# EAGLE design TXn_v1.2 (EAGLE 8.6.2)
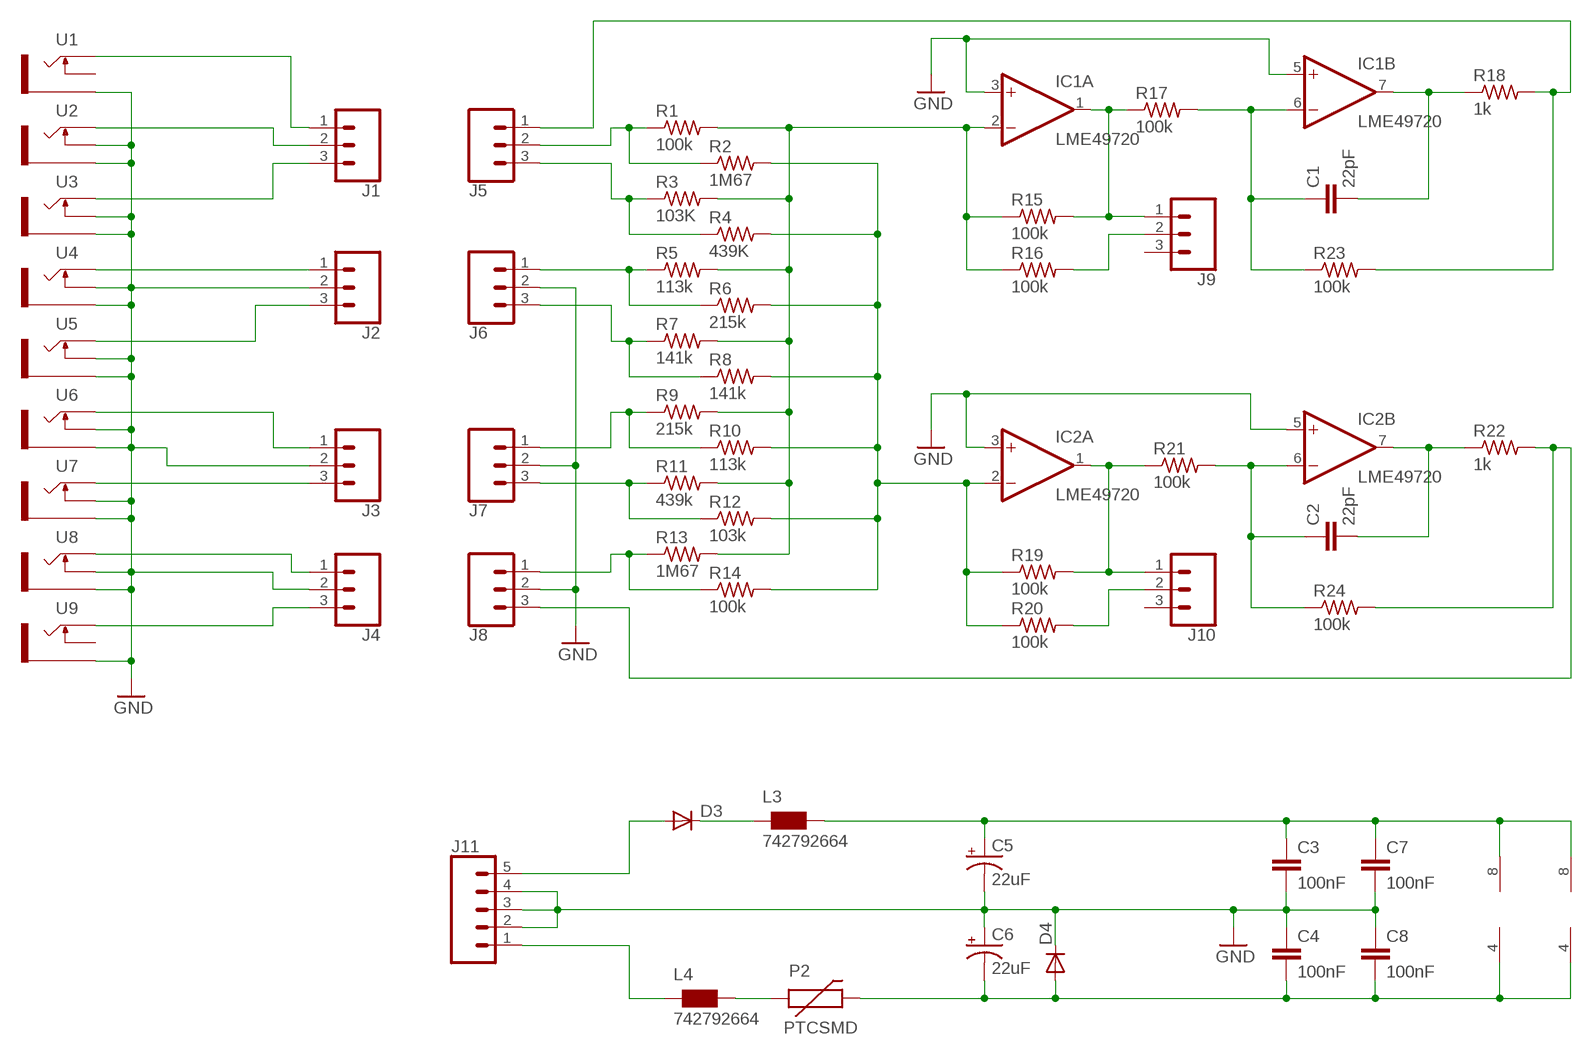
[diagram p0: schematic, sheet 1]

## Parts
C1  22pF  CAP0603-CAP  [0603-CAP]
C2  22pF  CAP0603-CAP  [0603-CAP]
C3  100nF  CAP0603-CAP  [0603-CAP]
C4  100nF  CAP0603-CAP  [0603-CAP]
C5  22uF  CPOL-USB  [PANASONIC_B]
C6  22uF  CPOL-USB  [PANASONIC_B]
C7  100nF  CAP0603-CAP  [0603-CAP]
C8  100nF  CAP0603-CAP  [0603-CAP]
D3  DIODE-SOD123  [SOD123]
D4  DIODE-SOD123  [SOD123]
IC1  LME49720  TL072D  [SO08]
IC2  LME49720  TL072D  [SO08]
J1  CONN_031X03_NO_SILK  [1X03_NO_SILK]
J2  CONN_031X03_NO_SILK  [1X03_NO_SILK]
J3  CONN_031X03_NO_SILK  [1X03_NO_SILK]
J4  CONN_031X03_NO_SILK  [1X03_NO_SILK]
J5  CONN_031X03_NO_SILK  [1X03_NO_SILK]
J6  CONN_031X03_NO_SILK  [1X03_NO_SILK]
J7  CONN_031X03_NO_SILK  [1X03_NO_SILK]
J8  CONN_031X03_NO_SILK  [1X03_NO_SILK]
J9  CONN_031X03_NO_SILK  [1X03_NO_SILK]
J10  CONN_031X03_NO_SILK  [1X03_NO_SILK]
J11  CONN_05NO_SILK  [1X05_NO_SILK]
L3  742792664  WE-CBF_0603  [0603]
L4  742792664  WE-CBF_0603  [0603]
P2  PTCSMD  [PTC-1206]
R1  100k  R-US_R0603  [R0603]
R2  1M67  R-US_R0603  [R0603]
R3  103K  R-US_R0603  [R0603]
R4  439K  R-US_R0603  [R0603]
R5  113k  R-US_R0603  [R0603]
R6  215k  R-US_R0603  [R0603]
R7  141k  R-US_R0603  [R0603]
R8  141k  R-US_R0603  [R0603]
R9  215k  R-US_R0603  [R0603]
R10  113k  R-US_R0603  [R0603]
R11  439k  R-US_R0603  [R0603]
R12  103k  R-US_R0603  [R0603]
R13  1M67  R-US_R0603  [R0603]
R14  100k  R-US_R0603  [R0603]
R15  100k  R-US_R0603  [R0603]
R16  100k  R-US_R0603  [R0603]
R17  100k  R-US_R0603  [R0603]
R18  1k  R-US_R0603  [R0603]
R19  100k  R-US_R0603  [R0603]
R20  100k  R-US_R0603  [R0603]
R21  100k  R-US_R0603  [R0603]
R22  1k  R-US_R0603  [R0603]
R23  100k  R-US_R0603  [R0603]
R24  100k  R-US_R0603  [R0603]
U1  THONKICONNLEFT  [WQP-PJ301M-12_JACK_L]
U2  THONKICONNLEFT  [WQP-PJ301M-12_JACK_L]
U3  THONKICONNLEFT  [WQP-PJ301M-12_JACK_L]
U4  THONKICONNLEFT  [WQP-PJ301M-12_JACK_L]
U5  THONKICONNLEFT  [WQP-PJ301M-12_JACK_L]
U6  THONKICONNLEFT  [WQP-PJ301M-12_JACK_L]
U7  THONKICONNLEFT  [WQP-PJ301M-12_JACK_L]
U8  THONKICONNLEFT  [WQP-PJ301M-12_JACK_L]
U9  THONKICONNLEFT  [WQP-PJ301M-12_JACK_L]

## Nets
BMIX: IC2.2(A:-IN) R2.2 R4.2 R6.2 R8.2 R10.2 R12.2 R14.2 R19.1 R20.1
BOUT: J8.3 R22.2 R24.2
GND: C3.2 C4.1 C5.- C6.+ C7.2 C8.1 D4.C IC1.3(A:+IN) IC1.5(B:+IN) IC2.3(A:+IN) IC2.5(B:+IN) J2.2 J3.2 J4.2 J6.2 J7.2 J8.2 J11.2 J11.3 J11.4 U1.P$3_SLEEVE(SLEEVE) U2.P$2_SWITCH(SWITCH) U2.P$3_SLEEVE(SLEEVE) U3.P$2_SWITCH(SWITCH) U3.P$3_SLEEVE(SLEEVE) U4.P$2_SWITCH(SWITCH) U4.P$3_SLEEVE(SLEEVE) U5.P$2_SWITCH(SWITCH) U5.P$3_SLEEVE(SLEEVE) U6.P$2_SWITCH(SWITCH) U6.P$3_SLEEVE(SLEEVE) U7.P$2_SWITCH(SWITCH) U7.P$3_SLEEVE(SLEEVE) U8.P$2_SWITCH(SWITCH) U8.P$3_SLEEVE(SLEEVE) U9.P$3_SLEEVE(SLEEVE)
N$2: J1.1 U1.P$1_TIP(TIP)
N$3: J5.2 R1.1 R2.1
N$4: J5.3 R3.1 R4.1
N$5: J6.1 R5.1 R6.1
N$6: J6.3 R7.1 R8.1
N$7: J7.3 R11.1 R12.1
N$8: J8.1 R13.1 R14.1
N$10: J7.1 R9.1 R10.1
N$11: J4.3 U9.P$1_TIP(TIP)
N$12: J4.1 U8.P$1_TIP(TIP)
N$13: J1.2 U2.P$1_TIP(TIP)
N$14: J1.3 U3.P$1_TIP(TIP)
N$15: J2.1 U4.P$1_TIP(TIP)
N$16: J2.3 U5.P$1_TIP(TIP)
N$17: J3.3 U7.P$1_TIP(TIP)
N$18: IC2.1(A:OUT) J10.1 R19.2 R21.1
N$19: J3.1 U6.P$1_TIP(TIP)
N$21: C2.1 IC2.6(B:-IN) R21.2 R24.1
N$23: IC1.1(A:OUT) J9.1 R15.2 R17.1
N$24: C1.1 IC1.6(B:-IN) R17.2 R23.1
N$25: C2.2 IC2.7(B:OUT) R22.1
N$26: J9.2 R16.2
N$27: C1.2 IC1.7(B:OUT) R18.1
N$30: J10.2 R20.2
N$33: D3.C L3.1
N$34: L4.2 P2.1
TMIX: IC1.2(A:-IN) R1.2 R3.2 R5.2 R7.2 R9.2 R11.2 R13.2 R15.1 R16.1
TOUT: J5.1 R18.2 R23.2
VCC: C3.1 C5.+ C7.1 IC1.8(P:V+) IC2.8(P:V+) L3.2
VCC1: D3.A J11.5
VEE: C4.2 C6.- C8.2 D4.A IC1.4(P:V-) IC2.4(P:V-) P2.2
VEE1: J11.1 L4.1
Unconnected: J9.3 J10.3 U1.P$2_SWITCH(SWITCH) U9.P$2_SWITCH(SWITCH)

## Library data of the parts
C1-C4 C7 C8 = SparkFun-Passives:CAP: Capacitor Standard 0603 ceramic capacitor, and 0.1" leaded capacitor.
C5 C6 = rcl:CPOL-US: POLARIZED CAPACITOR, American symbol; SPICEPREFIX: C
D3 D4 = diode:DIODE-: DIODE
IC1 = linear:TL072: OP AMP; SPICEPREFIX: J
IC2 = linear:TL072: OP AMP
J1-J10 = SparkFun-Connectors:CONN_03: Header 3 Standard 3-pin 0.1" header. Use with straight break away headers (SKU : PRT-00116), right angle break away headers (PRT-00553), swiss pins (PRT-00743), machine pins (PRT-00117), and female headers (PRT-00115). Molex polarized connector foot print use with SKU : PRT-08232 with associated crimp pins and housings.
J11 = SparkFun-Connectors:CONN_05: Header 5 Standard 5-pin 0.1" header. Use with straight break away headers (SKU : PRT-00116), right angle break away headers (PRT-00553), swiss pins (PRT-00743), machine pins (PRT-00117), and female headers (PRT-00115). Molex polarized connector foot print use with SKU : PRT-08230 with associated crimp pins and housings.
L3 L4 = wuerth-elektronik:WE-CBF: SMD EMI Suppression Ferrite Beads - excellent anti-EMI properties - low DCR - impedances till 3000 ohms - rated current up to 6 A
P2 = SparkFun:PTC: Resettable Fuse PTC Resettable Fuse. Spark Fun Electronics SKU : COM-08357
R1-R24 = adafruit:R-US_: RESISTOR, American symbol
U1-U9 = bpcmusic:THONKICONN: 3.5mm socket for Eurorack modular synths

## Board
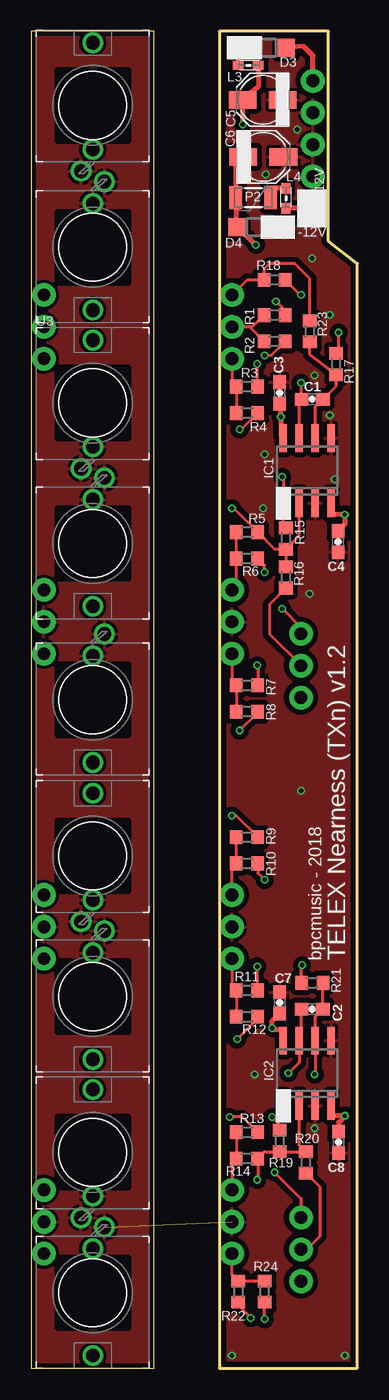
[diagram p1: board, top side]
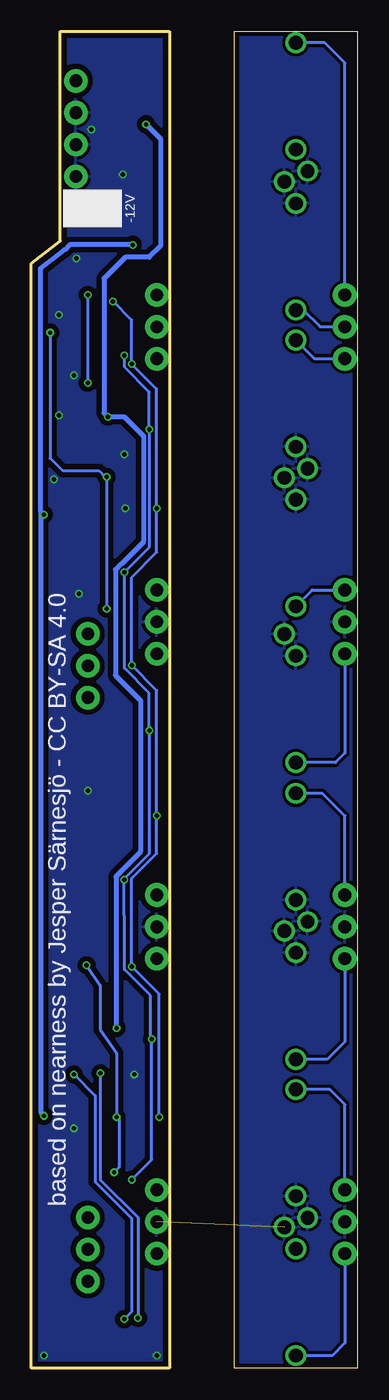
[diagram p2: board, bottom side, seen from below]

Size 26 x 106.5 mm. Coordinates in mm from the lower left corner, seen from the top.
Outline: 0,0 9.8,0 9.8,106.5 0,106.5 0,0
Outline: 15,0 26,0 26,88 23.7,89.8 23.7,106.5 15,106.5 15,0
Copper layers (1*16): Top 0.035559375mm / dielectric 1.6mm / Bottom 0.035559375mm
Design rules "oshpark-2layer (1)": minimum track width 6mil, minimum drill 10mil, track to track 6mil, track to pad 6mil, pad to pad 6mil, via to via 6mil, smd to smd 6mil, copper to edge 15mil, drill to drill 6mil, minimum pad ring 5mil, minimum via ring 5mil, stop-mask expansion 2.5mil, vias tented up to drill 0mil, thermal gap 10mil

### Footprints (pad centres in the part's own frame; a part is rotated, then mirrored left to right if it is on the bottom)
0603-CAP = smd 1.1 x 1: 1 -0.85,0; 2 0.85,0
PANASONIC_B = smd 2.2 x 1.4: + 1.6,0; - -1.6,0
SOD123 = smd 1.4 x 1.4: A 1.9,0; C -1.9,0
SO08 = smd 0.6 x 2.2: 1 -1.905,-2.6; 2 -0.635,-2.6; 3 0.635,-2.6; 4 1.905,-2.6; 5 1.905,2.6; 6 0.635,2.6; 7 -0.635,2.6; 8 -1.905,2.6
1X03_NO_SILK = drill 1.016 pad 1.88: 1 0,0; 2 2.54,0; 3 5.08,0
1X05_NO_SILK = drill 1.016 pad 1.88: 1 0,0; 2 2.54,0; 3 5.08,0; 4 7.62,0; 5 10.16,0
0603 = smd 0.85 x 0.7: 1 -0.9,0; 2 0.7,0
PTC-1206 = smd 1 x 1.8: 1 -1.4,0; 2 1.4,0
R0603 = smd 1 x 1.1: 1 -0.85,0; 2 0.85,0
WQP-PJ301M-12_JACK_L = drill 1.1: P$1_TIP 0,5; P$2_SWITCH 0,-3.5; P$3_SLEEVE -0.928,-5.23

### Placement (x,y rotation side)
C1  22.4,77.2 180 top
C2  22.4,28.6 180 top
C3  19.8,77.7 90 top
C4  24.45,65.85 90 top
C5  18.45,101.05 180 top
C6  18.5,96.5 0 top
C7  19.8,29.1 90 top
C8  24.5,18 90 top
D3  18.4,105.2 0 top
D4  18.3,90.9 180 top
IC1  22,71.5 0 top
IC2  22,23.5 0 top
J1  1,85.5 270 top
J2  1,62 270 top
J3  1,37.7 270 top
J4  1,14.2 270 top
J5  16,85.5 270 top
J6  16,62 270 top
J7  16,37.7 270 top
J8  16,14.2 270 top
J9  21.5,58.5 270 top
J10  21.5,12 270 top
J11  22.45,92.4 90 top
L3  17.4,103.8 0 top
L4  20.3,93.3 90 top
P2  17.7,93.25 180 top
R1  19.4,83.9 0 top
R2  19.4,81.8 0 top
R3  17.2,78.2 0 top
R4  17.2,76.1 0 top
R5  17.2,66.6 0 top
R6  17.2,64.5 0 top
R7  17.2,54.4 0 top
R8  17.2,52.3 0 top
R9  17.2,42.3 0 top
R10  17.2,40.2 0 top
R11  17.2,30.1 0 top
R12  17.2,28 0 top
R13  17.2,18.8 0 top
R14  17.2,16.7 0 top
R15  20.3,66.1 90 top
R16  20.3,63 270 top
R17  24.3,80 270 top
R18  19.4,86.7 180 top
R19  19.8,18.1 90 top
R20  21.9,16.4 270 top
R21  22.4,30.7 0 top
R22  16.5,6.1 90 top
R23  22.2,82.6 90 top
R24  18.6,6.1 90 top
U1  4.9,100.6 0 top
U2  4.9,89.3 180 top
U3  4.9,76.9 0 top
U4  4.9,65.7 180 top
U5  4.9,53.25 180 top
U6  4.9,40.8 0 top
U7  4.9,29.6 180 top
U8  4.9,17.2 0 top
U9  4.9,6 180 top

### Tracks (layer width: path | path; a pad name or v marks a point on that pad's centre or on a via)
BMIX  (via drill 0.35)
  Top 0.254: v18,15 18.05,15.05 R14.2 18.6,17.25 R19.1 R20.1 21.36,17.79 IC2.2 | v16.4,26.2 18.05,27.85 R12.2 | R10.2 18.05,39.45 v18.6,38.9 | v16.6,50.8 18.05,52.25 R8.2 | v18.6,63.4 18.6,63.95 R6.2 | v16.6,74.8 16.75,74.8 R4.2 | v18.6,80.7 19.15,80.7 R2.2
  Bottom 0.254: v18,15 16.4,16.6 v16.4,26.2 16.5,26.3 16.5,29.68 18.58,31.76 18.58,33.18 v18.6,38.9 18.41,39.09 18.41,39.17 16.58,40.99 16.58,50.78 v16.6,50.8 16.6,53.78 18.58,55.76 18.58,63.42 | 18.58,63.42 18.5,63.5 | 18.58,63.42 v18.6,63.4 16.58,65.42 16.58,74.68 16.6,74.7 v16.6,74.8 16.6,77.78 18.58,79.76 18.58,80.68 v18.6,80.7
BOUT
  Top 0.254: R24.2 R22.2 16,7.45 J8.3
GND  (via drill 0.35)  (1 unrouted)
  other vias: 25,1 16,1 21.2,98.7 22.4,88.4 22.6,79.1 23.8,75.9 21.5,46 18.5,68.5 23.8,83.9 18.6,72.8 24.2,70.8 22.2,61.7 18.7,95.1 22.6,19.1 17.8,23.4
  pour Top (isolate 0.254): -3,-1 -3,110 12,110 13,109 13,-2 -2,-2
  pour Bottom (isolate 0.254): -2,-4 12,-4 12,110 -1,110 -2,109
  pour Top (isolate 0.406): 15,0 15,107 29,107 28,0
  pour Bottom (isolate 0.406): 14,0 14,107 27,107 27,0
N$2
  Bottom 0.254: J1.1 1,104 2.6,105.6 U1.P$1_TIP
N$3
  Top 0.254: J5.2 17,82.96 17.39,82.96 | 17.39,82.96 R2.1 | 17.39,82.96 17.61,82.96 R1.1
N$4
  Top 0.254: J5.3 16,78.55 R3.1 R4.1
N$5
  Top 0.254: J6.1 16.35,62.35 R6.1 R5.1
N$6
  Top 0.254: J6.3 16,54.75 R7.1 R8.1
N$7
  Top 0.254: J7.3 16,30.45 R11.1 R12.1
N$8
  Top 0.254: J8.1 16,16.35 R14.1 R13.1
N$10
  Top 0.254: J7.1 16,39.85 R10.1 R9.1
N$11
  Bottom 0.254: J4.3 1,2 2,1 U9.P$1_TIP
N$12
  Bottom 0.254: J4.1 1,21 2.2,22.2 U8.P$1_TIP
N$13
  Bottom 0.254: U2.P$1_TIP 4.3,84.3 2.96,82.96 J1.2
N$14
  Bottom 0.254: U3.P$1_TIP 3.42,80.42 J1.3
N$15
  Bottom 0.254: U4.P$1_TIP 3.6,62 J2.1
N$16
  Bottom 0.254: J2.3 1,49 1.75,48.25 U5.P$1_TIP
N$17
  Bottom 0.254: J3.3 1,26 2.4,24.6 U7.P$1_TIP
N$18  (via drill 0.35)
  Top 0.254: R21.1 21.55,32.05 v21.6,32.1 | v19.2,20 19,20 | v19.2,20 20,20 20.09,20.09 IC2.1 | v19.2,20 19.8,19.4 R19.2 | v19.4,15.6 21.5,13.5 J10.1
  Bottom 0.254: v21.6,32.1 20.5,30.5 20.5,27 19.2,25.1 v19.2,20 19,19.8 19,16 v19.4,15.6
N$19
  Bottom 0.254: J3.1 1,44 2.8,45.8 U6.P$1_TIP
N$21  (via drill 0.35)
  Top 0.254: R21.2 C2.1 22.64,27.98 IC2.6 22.64,23.57 22.7,23.5 v22.6,23.4 | v18.6,3.9 R24.1
  Bottom 0.254: v22.6,23.4 20.91,21.71 20.91,14.83 18,11.93 18,4.5 v18.6,3.9
N$23  (via drill 0.35)
  Top 0.254: R17.1 24.5,81.05 v24.5,82.5 | v20,71 20.09,70.91 IC1.1 20.09,67.16 R15.2 | v20,60.5 21.5,59 J9.1
  Bottom 0.254: v24.5,82.5 24.5,72.5 23.5,71.5 20.6,71.5 20.1,71 v20,71 v20,60.5
N$24
  Top 0.254: IC1.6 22.64,76.58 C1.1 24.3,78.25 R17.2 22.2,80.75 R23.1
N$25  (via drill 0.35)
  Top 0.254: C2.2 21.55,26.29 IC2.7 21.36,24.36 v20.5,23.5 | v17.5,4 16.5,5 R22.1
  Bottom 0.254: v20.5,23.5 20.5,15 17.5,12 v17.5,4
N$26
  Top 0.254: R16.2 19,60.85 19,58.5 21.5,56 J9.2
N$27  (via drill 0.35)
  Top 0.254: IC1.7 21.36,77.02 21.5,77.15 | 21.5,77.15 C1.2 | R18.1 21.5,85.45 v21.5,85.5 | v21.5,78.5 21.5,77.15
  Bottom 0.254: v21.5,85.5 v21.5,78.5
N$30
  Top 0.254: R20.2 23,14.45 23,10.5 21.96,9.46 J10.2
N$33
  Top 0.406: D3.C L3.1
N$34
  Top 0.406: L4.2 19,94 19,93.35 P2.1
TMIX  (via drill 0.35)
  Top 0.254: R13.2 16.85,20 v15.81,20 | v18,32 18,30.15 R11.2 | v16,44 16.35,44 R9.2 | v18,56 18.05,55.95 R7.2 | v16,68.5 16.15,68.5 R5.2 19.4,65.25 R15.1 | v18,80 18,78.25 R3.2 | v19.5,85 20.25,84.25 R1.2 | R15.1 21.36,66.31 IC1.2 | R15.1 R16.1
  Bottom 0.254: v15.81,20 15.81,29.81 v18,32 18,39 16,41 v16,44 16,54 v18,56 18,63 16,65 v16,68.5 16,78 v18,80 18,83.5 v19.5,85
TOUT
  Top 0.254: R23.2 22.2,86.8 21,88 19,88 18.55,87.55 R18.2 17.2,86.7 J5.1
VCC  (via drill 0.35)
  Top 0.406: L3.2 18.1,102.1 C5.+ v16.85,99.1 16.8,99.1 | C3.1 19.9,76.75 v19.9,75.8 19.9,74.3 IC1.8 | C7.1 19.2,27.65 v19.2,27.1 19.3,27 20,27 20.09,26.91 IC2.8
  Bottom 0.406: v16.85,99.1 15.71,97.96 15.71,89.4 16.61,88.5 18.5,88.5 20.2,86.8 20.2,76.1 v19.9,75.8 18.6,75.8 17.06,74.26 17.06,65.8 18.81,64.06 18.87,64.06 19.3,63.63 19.3,55.2 17.3,53.2 17.3,41.13 19.26,39.17 19.26,27.14 19.3,27.1 v19.2,27.1
VCC1
  Top 0.406: J11.5 22.45,104.55 21.7,105.3 D3.A
VEE  (via drill 0.35)
  Top 0.406: C6.- 16.3,95.9 P2.2 16.3,91 D4.A v17.9,89.5 | IC1.4 24,68.81 24,68 v25,68 25,67.25 C4.2 | IC2.4 23.91,20.09 24,20 24.1,20.1 v25,20.1 24.5,19.6 C8.2
  Bottom 0.406: v17.9,89.5 22.95,89.5 23.36,89.09 23.39,89.09 25.29,87.6 25.29,68.29 25.25,68.25 | 25.25,68.25 v25,68 | 25.25,68.25 25.25,20.35 v25,20.1
VEE1
  Top 0.406: J11.1 L4.1

### Text on the board
tNames: -12V | -12V | bpcmusic - 2018 | TELEX Nearness (TXn) v1.2
bNames: -12V | based on nearness by Jesper Särnesjö - CC BY-SA 4.0